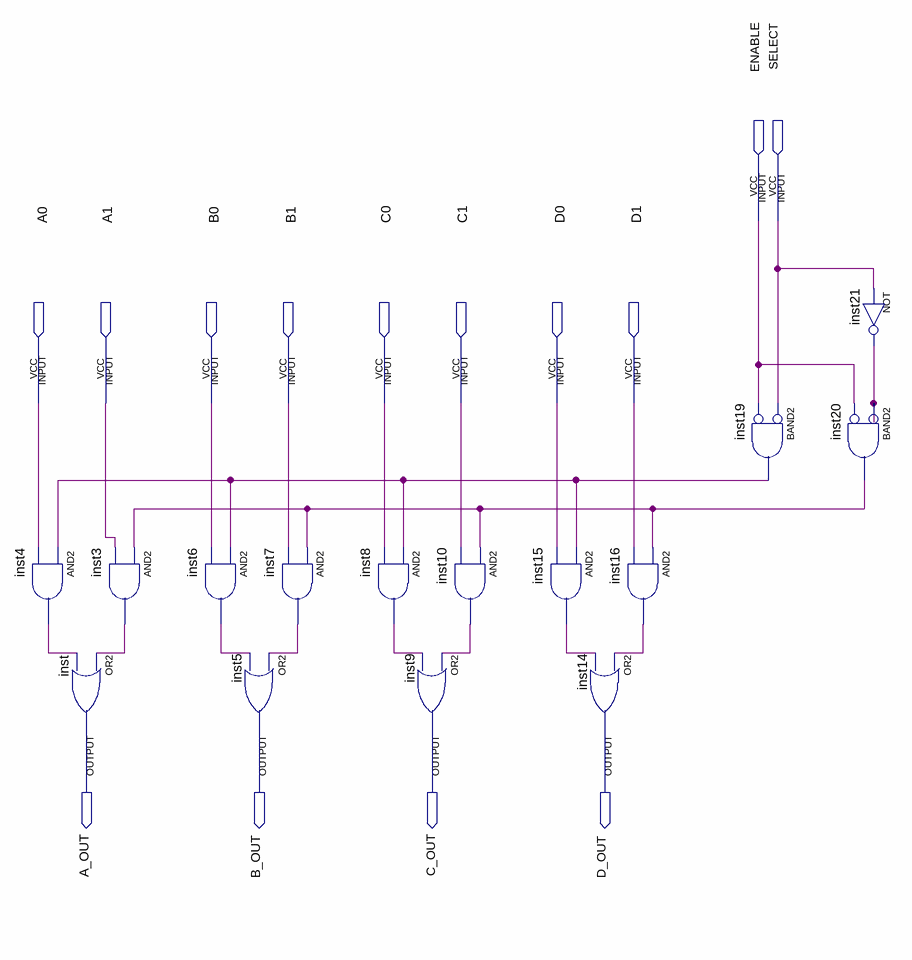
[diagram p0: schematic sheet]
// Quartus schematic ALP74LS157.bdf as structural Verilog: 15 symbols, 14 pins
module ALP74LS157 (
  input  ENABLE,
  input  SELECT,
  input  A0,
  input  A1,
  input  B0,
  input  B1,
  input  C0,
  input  C1,
  input  D0,
  input  D1,
  output A_OUT,
  output B_OUT,
  output C_OUT,
  output D_OUT
);

  wire inst3_out, inst4_out, inst6_out, inst7_out, inst8_out, inst10_out, inst15_out, inst16_out, inst19_out,
       inst20_out, inst21_out;

  and inst4 (inst4_out, inst19_out, A0);
  and inst3 (inst3_out, inst20_out, A1);
  or inst (A_OUT, inst3_out, inst4_out);
  and inst6 (inst6_out, inst19_out, B0);
  or inst5 (B_OUT, inst7_out, inst6_out);
  and inst7 (inst7_out, inst20_out, B1);
  and inst8 (inst8_out, inst19_out, C0);
  or inst9 (C_OUT, inst10_out, inst8_out);
  and inst10 (inst10_out, inst20_out, C1);
  and inst15 (inst15_out, inst19_out, D0);
  and inst16 (inst16_out, inst20_out, D1);
  or inst14 (D_OUT, inst16_out, inst15_out);
  and inst19 (inst19_out, ~SELECT, ~ENABLE);  // BAND2
  not inst21 (inst21_out, SELECT);
  and inst20 (inst20_out, ~inst21_out, ~ENABLE);  // BAND2
endmodule
